# EAGLE schematic twip-mb2 (EAGLE 9.2.1)
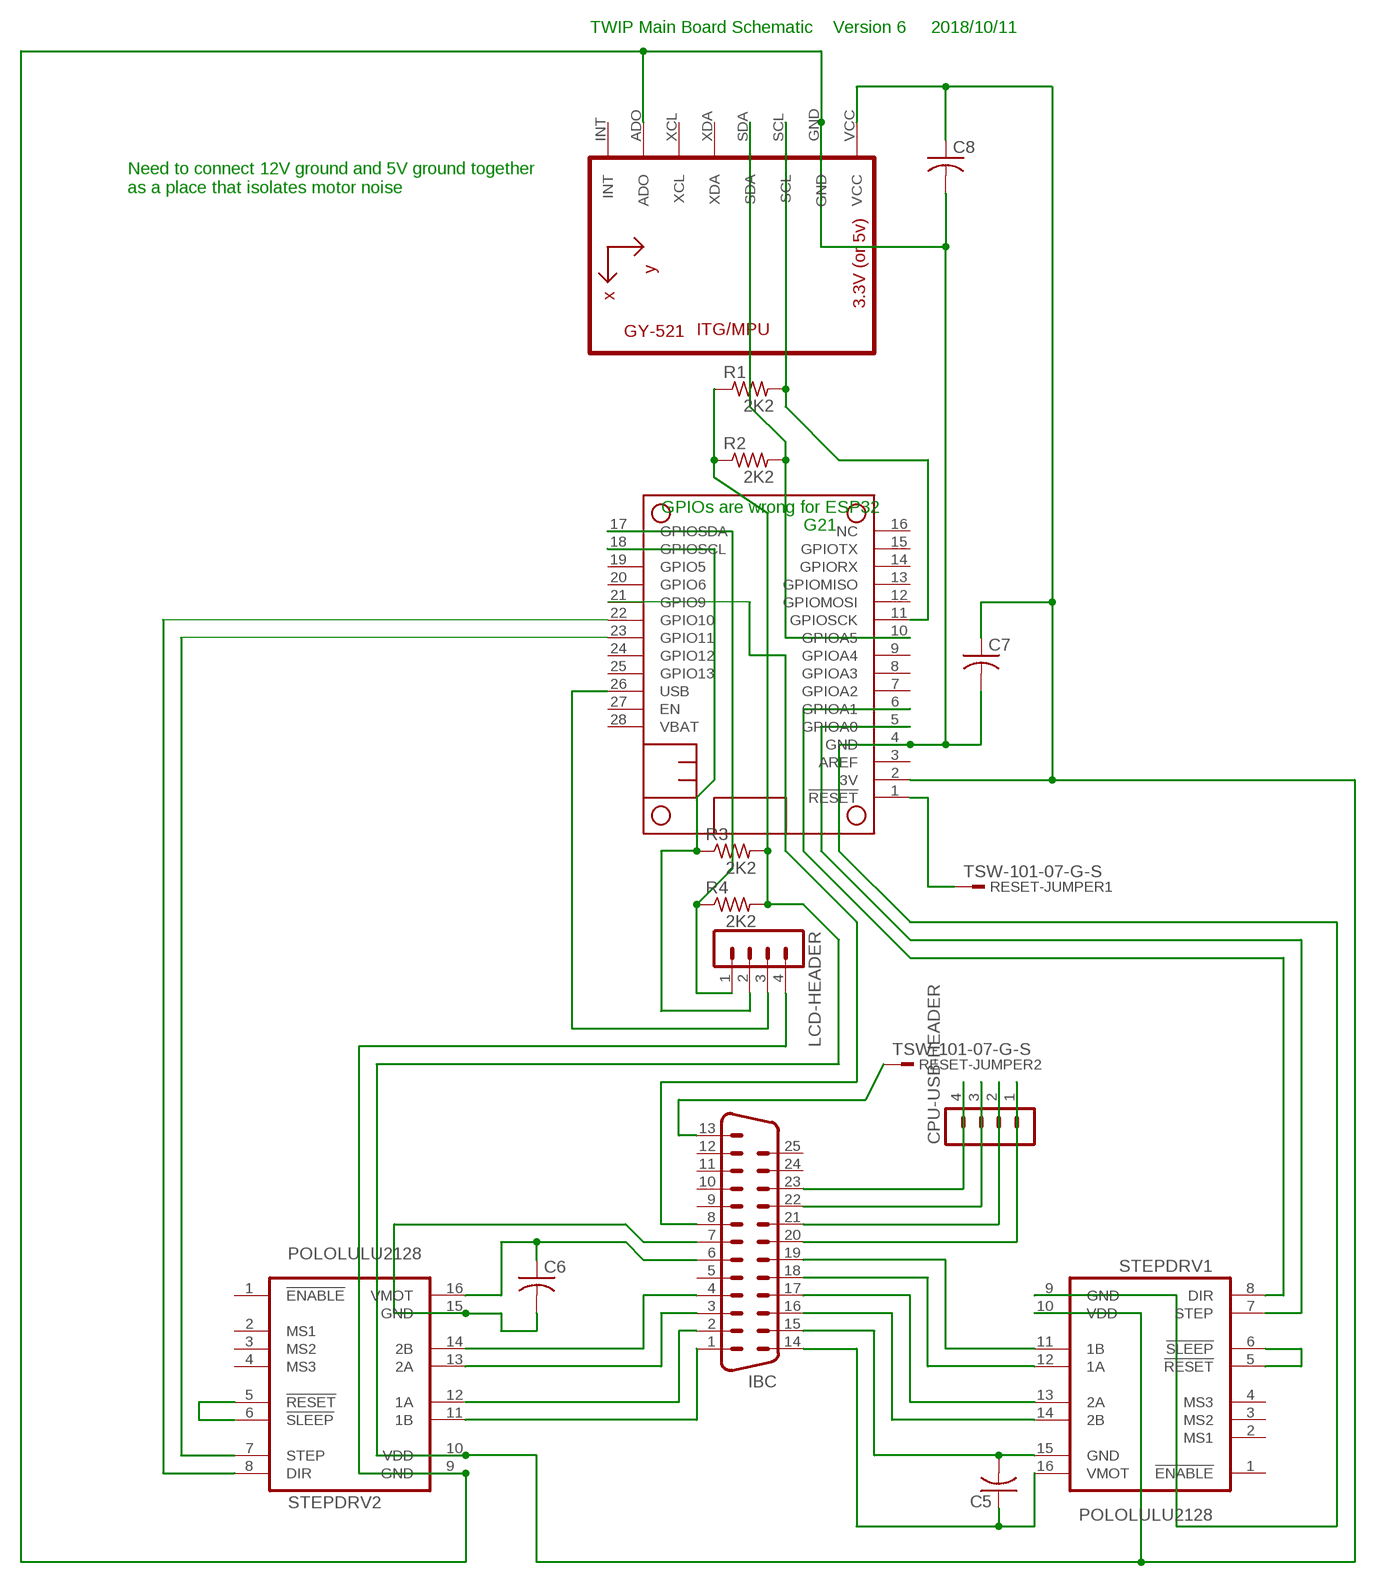
[diagram p0: schematic, sheet 1]

## Parts
C5  C-US050-024X044  [C050-024X044]
C6  C-US050-024X044  [C050-024X044]
C7  C-US050-024X044  [C050-024X044]
C8  C-US050-024X044  [C050-024X044]
CPU-USB-HEADER  MA04-1  [MA04-1]
IBC  M25VP  [M25VP]
LCD-HEADER  MA04-1  [MA04-1]
MS2  FEATHERWING_NOHOLES  [FEATHERWING_NOHOLES]
R1  2K2  R-US_0309/12  [0309/12]
R2  2K2  R-US_0309/12  [0309/12]
R3  2K2  R-US_0309/12  [0309/12]
R4  2K2  R-US_0309/12  [0309/12]
RESET-JUMPER1  TSW-101-07-G-S  [TSW-101-XX-G-S]
RESET-JUMPER2  TSW-101-07-G-S  [TSW-101-XX-G-S]
STEPDRV1  POLOLULU2128  [POLOLULU2128]
STEPDRV2  POLOLULU2128  [POLOLULU2128]
U1  GY-521MPU6050  [GY-521]

## Nets
3V: C7.1 C8.1 MS2.2(3V) R1.1 R2.1 R3.2 R4.2 STEPDRV1.10(VDD) STEPDRV2.10(VDD) U1.VCC
N$1: IBC.13 RESET-JUMPER2.1
N$2: C6.2 IBC.7 STEPDRV2.15(GND)
N$3: IBC.16 STEPDRV1.14(2B)
N$4: IBC.17 STEPDRV1.13(2A)
N$5: MS2.5(GPIOA0) STEPDRV1.7(STEP)
N$6: IBC.18 STEPDRV1.12(1A)
N$7: IBC.19 STEPDRV1.11(1B)
N$8: IBC.1 STEPDRV2.11(1B)
N$9: IBC.2 STEPDRV2.12(1A)
N$10: IBC.3 STEPDRV2.13(2A)
N$11: LCD-HEADER.2 MS2.18(GPIOSCL) R3.1
N$12: IBC.4 STEPDRV2.14(2B)
N$13: CPU-USB-HEADER.4 IBC.23
N$14: CPU-USB-HEADER.3 IBC.22
N$15: MS2.6(GPIOA1) STEPDRV1.8(DIR)
N$16: MS2.1(!RESET) RESET-JUMPER1.1
N$17: MS2.11(GPIOSCK) R1.2 U1.SCL
N$18: CPU-USB-HEADER.2 IBC.21
N$19: LCD-HEADER.1 MS2.17(GPIOSDA) R4.1
N$20: C5.2 IBC.15 STEPDRV1.15(GND)
N$21: C6.1 IBC.6 STEPDRV2.16(VMOT)
N$22: C5.1 IBC.14 STEPDRV1.16(VMOT)
N$23: STEPDRV1.5(!RESET) STEPDRV1.6(!SLEEP)
N$24: STEPDRV2.5(!RESET) STEPDRV2.6(!SLEEP)
N$25: MS2.10(GPIOA5) R2.2 U1.SDA
N$27: MS2.22(GPIO10) STEPDRV2.8(DIR)
N$28: IBC.8 MS2.21(GPIO9)
N$29: MS2.23(GPIO11) STEPDRV2.7(STEP)
N$30: CPU-USB-HEADER.1 IBC.20
N$35: C7.2 C8.2 LCD-HEADER.4 MS2.4(GND) STEPDRV1.9(GND) STEPDRV2.9(GND) U1.ADO U1.GND
USB: LCD-HEADER.3 MS2.26(USB)
Unconnected: IBC.5 IBC.9 IBC.10 IBC.11 IBC.12 IBC.24 IBC.25 IBC.G1 IBC.G2 MS2.3(AREF) MS2.7(GPIOA2) MS2.8(GPIOA3) MS2.9(GPIOA4) MS2.12(GPIOMOSI) MS2.13(GPIOMISO) MS2.14(GPIORX) MS2.15(GPIOTX) MS2.16(NC) MS2.19(GPIO5) MS2.20(GPIO6) MS2.24(GPIO12) MS2.25(GPIO13) MS2.27(EN) MS2.28(VBAT) STEPDRV1.1(!ENABLE) STEPDRV1.2(MS1) STEPDRV1.3(MS2) STEPDRV1.4(MS3) STEPDRV2.1(!ENABLE) STEPDRV2.2(MS1) STEPDRV2.3(MS2) STEPDRV2.4(MS3) U1.INT U1.XCL U1.XDA

## Notes on the sheet
- TWIP Main Board Schematic    Version 6     2018/10/11
- Need to connect 12V ground and 5V ground together
  as a place that isolates motor noise
- GPIOs are wrong for ESP32
- G21

## Library data of the parts
C5-C8 = rcl:C-US: CAPACITOR, American symbol; SPICEPREFIX: C
CPU-USB-HEADER LCD-HEADER = con-lstb:MA04-1: PIN HEADER; OC_FARNELL: unknown; OC_NEWARK: unknown
IBC = con-subd:M25VP: SUB-D; OC_FARNELL: unknown; OC_NEWARK: unknown
MS2 = microbuilder:FEATHERWING
R1-R4 = resistor:R-US_: RESISTOR, American symbol
RESET-JUMPER1 RESET-JUMPER2 = con-samtec:TSW-101-*-G-S: THROUGH-HOLE .025" SQ POST HEADER Source: Samtec TSW.pdf; MF: Samtec Inc.; MPN: TSW-101-07-G-S
STEPDRV1 STEPDRV2 = stepper_drivers_etc:POLOLULU2128
U1 = gy-521:GY-521